# EAGLE design NU32PIC (EAGLE 5.12)
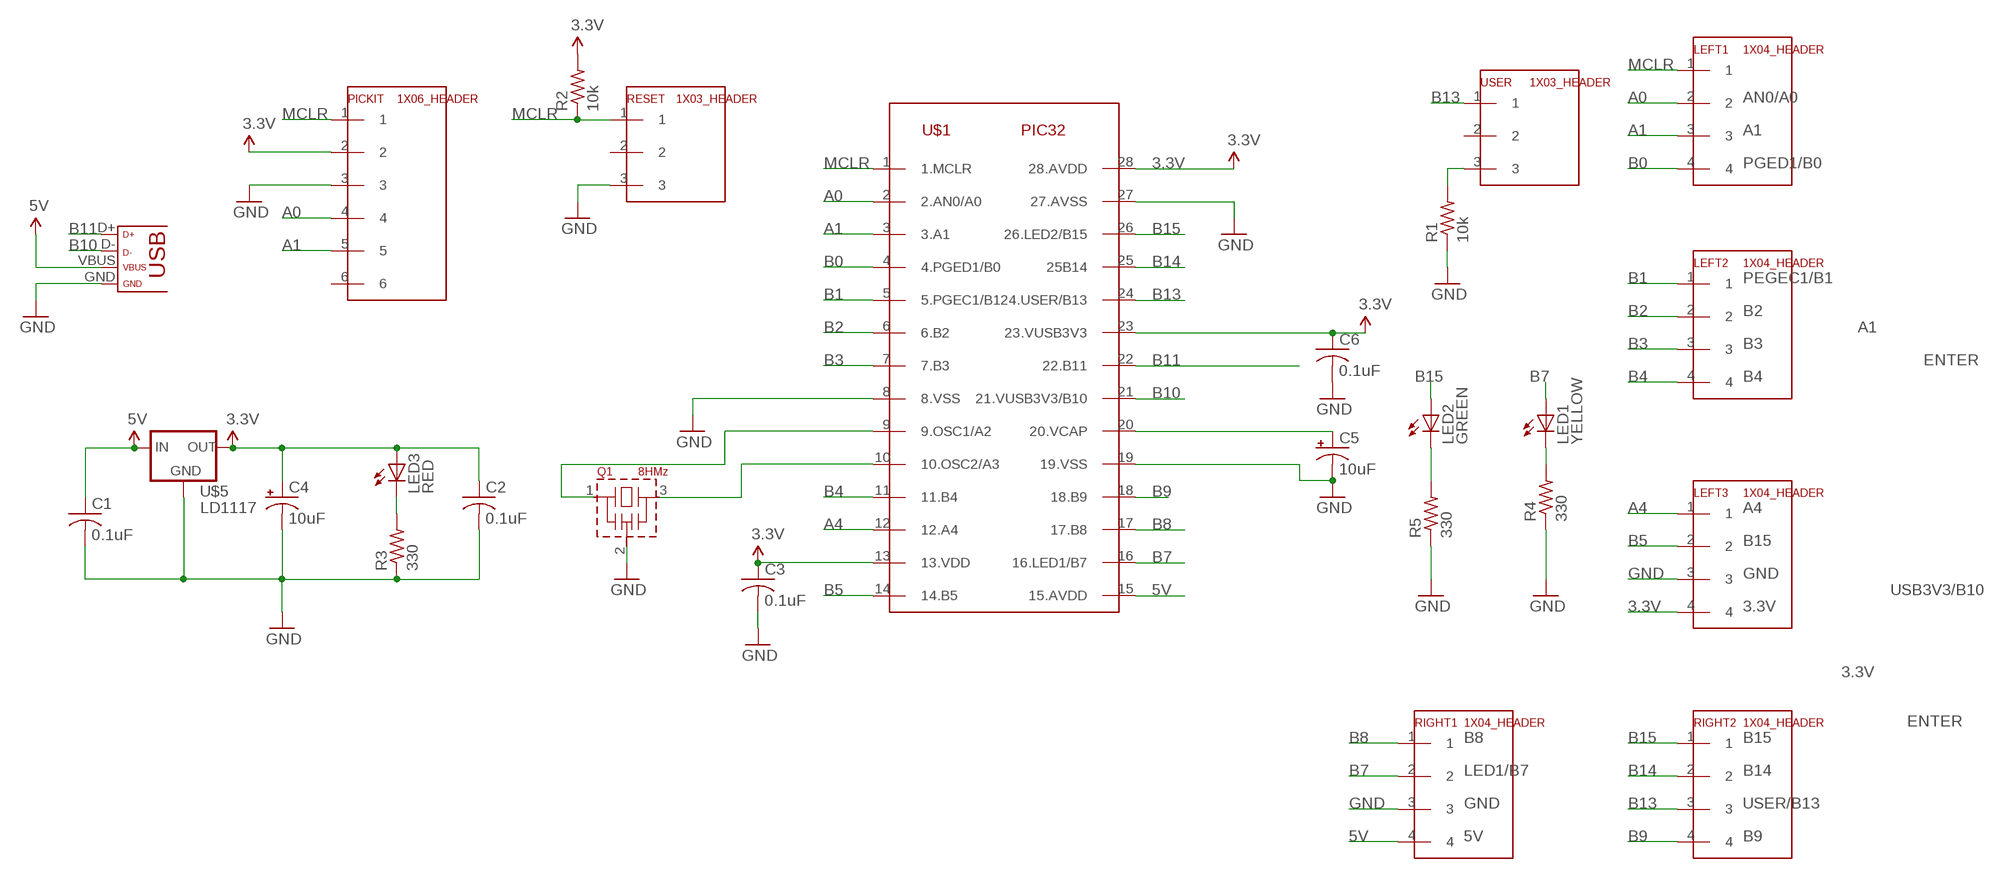
[diagram p0: schematic, sheet 1]

## Parts
C1  0.1uF  C-US025-025X050  [C025-025X050]
C2  0.1uF  C-US025-025X050  [C025-025X050]
C3  0.1uF  C-US025-025X050  [C025-025X050]
C4  10uF  CAP_POL  [CAP_POL_D]
C5  10uF  CAP_POL  [CAP_POL_D]
C6  0.1uF  C-US025-025X050  [C025-025X050]
LED1  YELLOW  LED3MM  [LED3MM]
LED2  GREEN  LED3MM  [LED3MM]
LED3  RED  LED3MM  [LED3MM]
LEFT1  1X04_HEADER  [1X04]
LEFT2  1X04_HEADER  [1X04]
LEFT3  1X04_HEADER  [1X04]
PICKIT  1X06_HEADER  [1X06]
Q1  8HMz  CSTLS_G*  [CSTLS_G9]
R1  10k  R-US_0207/10  [0207/10]
R2  10k  R-US_0207/10  [0207/10]
R3  330  R-US_0207/10  [0207/10]
R4  330  R-US_0207/10  [0207/10]
R5  330  R-US_0207/10  [0207/10]
RESET  1X03_HEADER  [1X03]
RIGHT1  1X04_HEADER  [1X04]
RIGHT2  1X04_HEADER  [1X04]
U$1  PIC32  [DIL28-3]
U$2  USB  [USB-MINIB]
U$5  LD1117  [TO220]
USER  1X03_HEADER  [1X03]

## Nets
3.3V: C2.1 C3.1 C4.1(+) C6.1 LED3.A LEFT3.4 PICKIT.2 R2.2 U$1.13(13.VDD) U$1.23(23.VUSB3V3) U$1.28(28.AVDD) U$5.2(OUT)
5V: C1.1 RIGHT1.4 U$1.15(15.AVDD) U$2.VBUS U$5.3(IN)
A0: LEFT1.2 PICKIT.4 U$1.2(2.AN0/A0)
A1: LEFT1.3 PICKIT.5 U$1.3(3.A1)
A4: LEFT3.1 U$1.12(12.A4)
B0: LEFT1.4 U$1.4(4.PGED1/B0)
B1: LEFT2.1 U$1.5(5.PGEC1/B1)
B2: LEFT2.2 U$1.6(6.B2)
B3: LEFT2.3 U$1.7(7.B3)
B4: LEFT2.4 U$1.11(11.B4)
B5: LEFT3.2 U$1.14(14.B5)
B7: LED1.A RIGHT1.2 U$1.16(16.LED1/B7)
B8: RIGHT1.1 U$1.17(17.B8)
B9: RIGHT2.4 U$1.18(18.B9)
B10: U$1.21(21.VUSB3V3/B10) U$2.D-
B11: U$1.22(22.B11) U$2.D+
B13: RIGHT2.3 U$1.24(24.USER/B13)
B14: RIGHT2.2 U$1.25(25B14)
B15: LED2.A RIGHT2.1 U$1.26(26.LED2/B15)
GND: C1.2 C2.2 C3.2 C4.2(-) C5.2(-) C6.2 LEFT3.3 PICKIT.3 Q1.2(VSS) R1.1 R3.1 R4.1 R5.1 RESET.3 RIGHT1.3 U$1.8(8.VSS) U$1.19(19.VSS) U$1.27(27.AVSS) U$2.GND U$5.1(GND)
MCLR: LEFT1.1 PICKIT.1 R2.1 RESET.1 U$1.1(1.MCLR)
N$3: LED3.K(C) R3.2
N$8: LED2.K(C) R5.2
N$11: LED1.K(C) R4.2
N$14: C5.1(+) U$1.20(20.VCAP)
N$26: Q1.1 U$1.9(9.OSC1/A2)
N$37: Q1.3 U$1.10(10.OSC2/A3)
N$38: R1.2 USER.3
Unconnected: PICKIT.6 RESET.2 USER.1 USER.2

## Notes on the sheet
- AN0/A0
- A1
- PGED1/B0
- PEGEC1/B1
- B2
- A1
- B3
- ENTER
- B4
- A4
- B15
- GND
- USB3V3/B10
- 3.3V
- 3.3V
- ENTER
- B8 | B15
- LED1/B7 | B14
- GND | USER/B13
- 5V | B9

## Library data of the parts
C1-C3 C6 = NU32PIC:C-US: CAPACITOR, American symbol
C4 C5 = NU32PIC:CAP_POL
LED1-LED3 = NU32PIC:LED: LED OSRAM: - CHIPLED LG R971, LG N971, LY N971, LG Q971, LY Q971, LO R971, LY R971 LH N974, LH R974 LS Q976, LO Q976, LY Q976 LO Q996 - Hyper CHIPLED LW Q18S LB Q993, LB Q99A, LB R99A - SideLED LS A670, LO A670, LY A670, LG A670, LP A670 LB A673, LV A673, LT A673, LW A673 LH A674 LY A675 LS A676, LA A676, LO A676, LY A676, LW A676 LS A679, LY A679, LG A679 - Hyper Micro SIDELED® LS Y876, LA Y876, LO Y876, LY Y876 LT Y87S - SmartLED LW L88C, LW L88S LB L89C, LB L89S, LG L890 LS L89K, LO L89K, LY L89K LS L896, LA L896, LO L896, LY L896 - TOPLED LS T670, LO T670, LY T670, LG T670, LP T670 LSG T670, LSP T670, LSY T670, LOP T670, LYG T670 LG T671, LOG T671, LSG T671 LB T673, LV T673, LT T673, LW T673 LH T674 LS T676, LA T676, LO T676, LY T676, LB T676, LH T676, LSB T676, LW T676 LB T67C, LV T67C, LT T67C, LS T67K, LO T67K, LY T67K, LW E67C LS E67B, LA E67B, LO E67B, LY E67B, LB E67C, LV E67C, LT E67C LW T67C LS T679, LY T679, LG T679 LS T770, LO T770, LY T770, LG T770, LP T770 LB T773, LV T773, LT T773, LW T773 LH T774 LS E675, LA E675, LY E675, LS T675 LS T776, LA T776, LO T776, LY T776, LB T776 LHGB T686 LT T68C, LB T68C - Hyper Mini TOPLED® LB M676 - Mini TOPLED Santana® LG M470 LS M47K, LO M47K, LY M47K Source: http://www.osram.convergy.de LUXEON: - LUMILED® LXK2-PW12-R00, LXK2-PW12-S00, LXK2-PW14-U00, LXK2-PW14-V00 LXK2-PM12-R00, LXK2-PM12-S00, LXK2-PM14-U00 LXK2-PE12-Q00, LXK2-PE12-R00, LXK2-PE12-S00, LXK2-PE14-T00, LXK2-PE14-U00 LXK2-PB12-K00, LXK2-PB12-L00, LXK2-PB12-M00, LXK2-PB14-N00, LXK2-PB14-P00, LXK2-PB14-Q00 LXK2-PR12-L00, LXK2-PR12-M00, LXK2-PR14-Q00, LXK2-PR14-R00 LXK2-PD12-Q00, LXK2-PD12-R00, LXK2-PD12-S00 LXK2-PH12-R00, LXK2-PH12-S00 LXK2-PL12-P00, LXK2-PL12-Q00, LXK2-PL12-R00 Source: www.luxeon.com KINGBRIGHT: KA-3528ASYC Source: www.kingbright.com
LEFT1-LEFT3 RIGHT1 RIGHT2 = NU32PIC:1X04_HEADER
PICKIT = NU32PIC:1X06_HEADER
Q1 = NU32PIC:CSTLS_G: Ceramic resonator 2.00 to 10.00 MHz
R1-R5 = NU32PIC:R-US_: RESISTOR, American symbol
RESET USER = NU32PIC:1X03_HEADER
U$1 = NU32PIC:PIC32
U$2 = NU32PIC:USB
U$5 = NU32PIC:LD1117

## Board
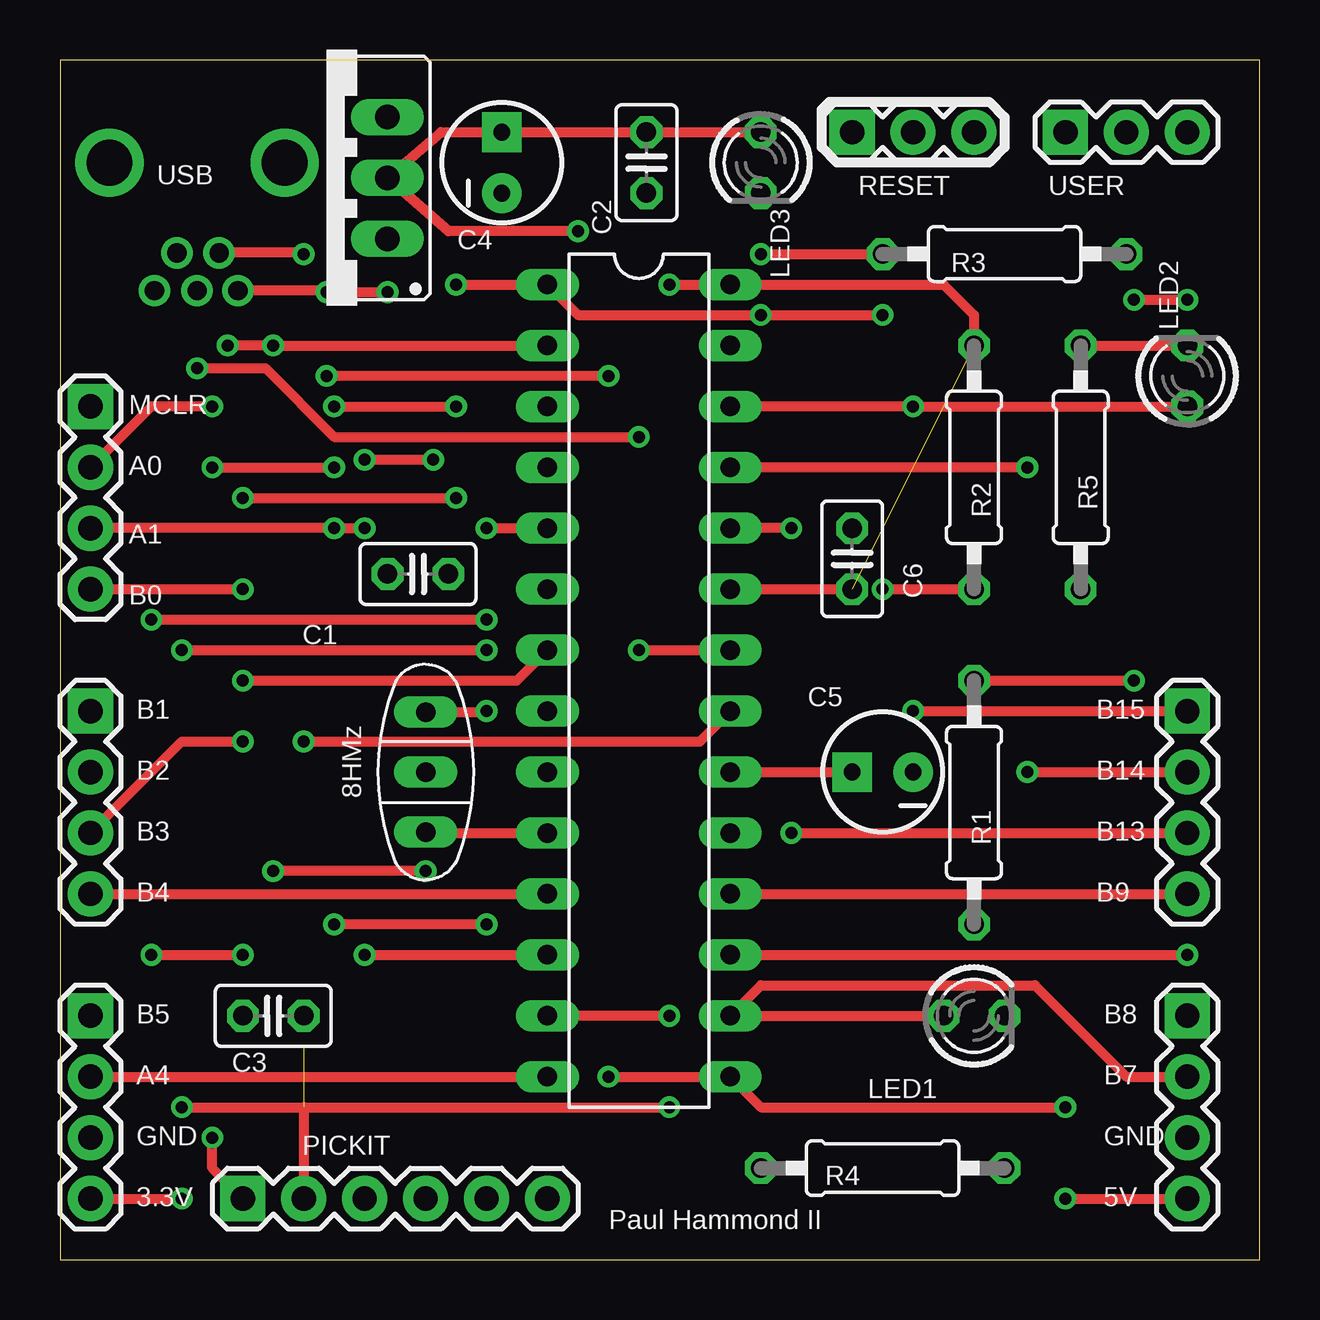
[diagram p1: board, top side]
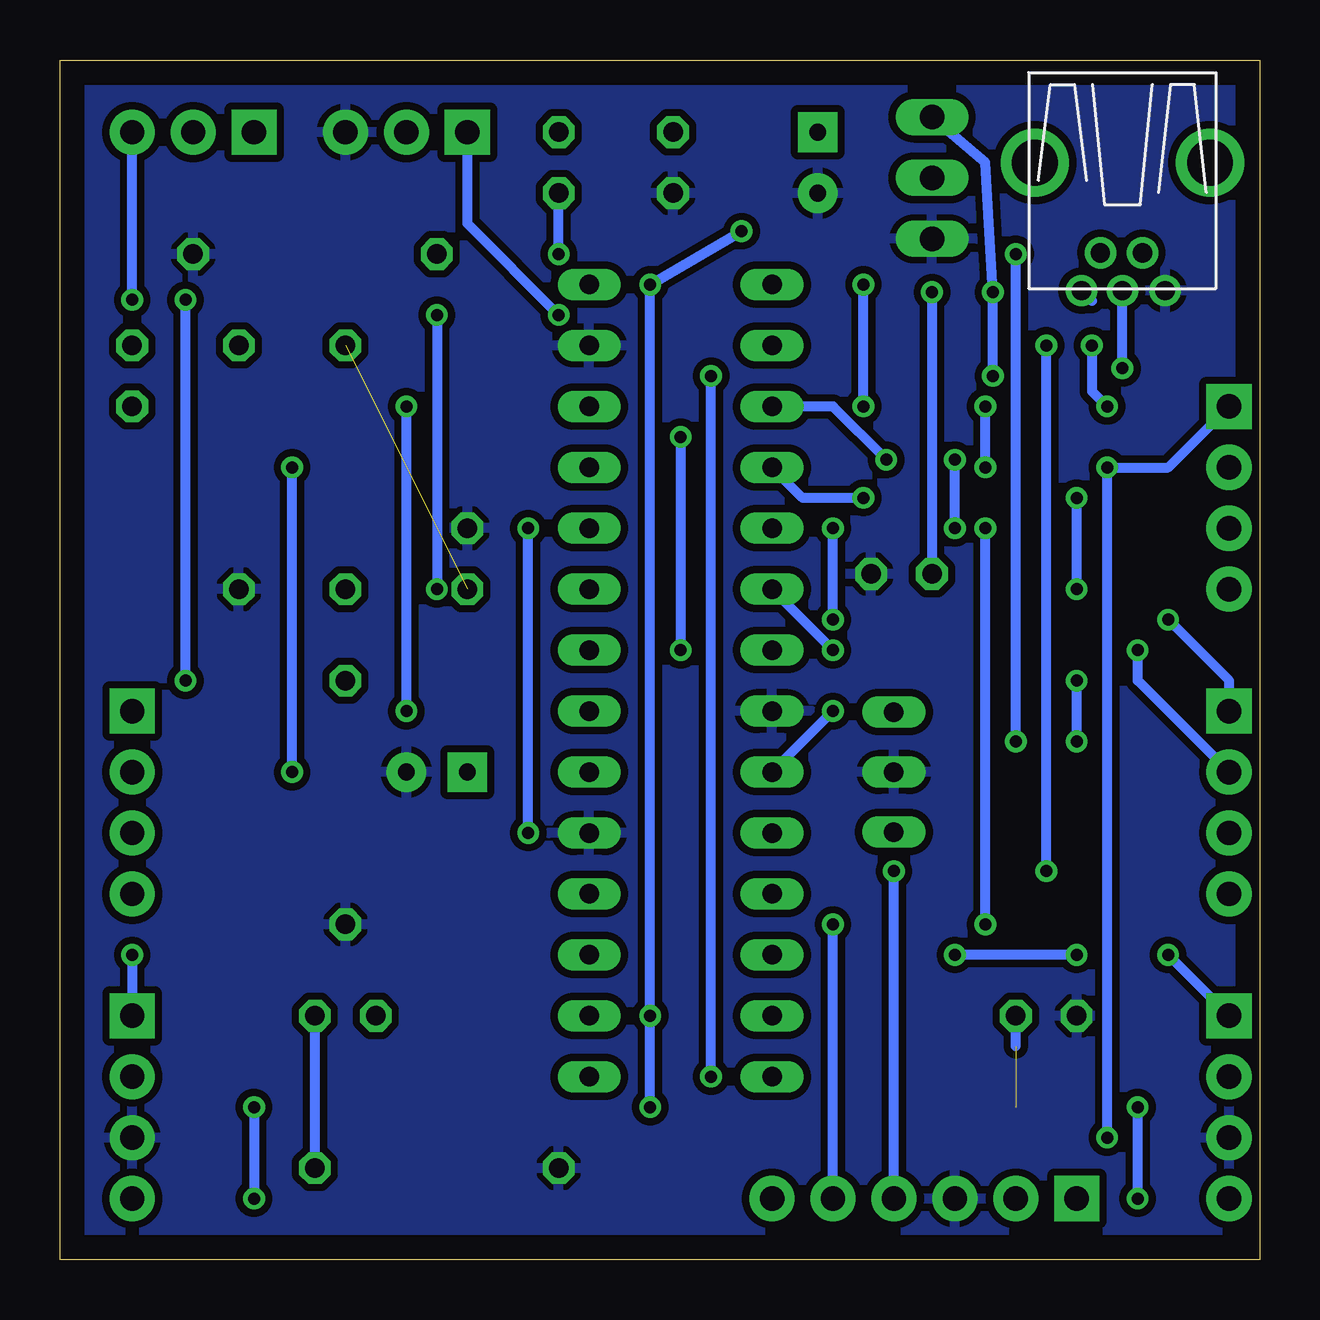
[diagram p2: board, bottom side, seen from below]

Size 50 x 50 mm. Coordinates in mm from the lower left corner, seen from the top.
Outline: 0,0 50,0 50,50 0,50 0,0
Copper layers (1*16): Top 0.035mm / dielectric 1.5mm / Bottom 0.035mm
Design rules "default": minimum track width 10mil, minimum drill 24mil, track to track 8mil, track to pad 8mil, pad to pad 8mil, via to via 8mil, smd to smd 8mil, copper to edge 40mil, drill to drill 8mil, minimum pad ring 10mil, minimum via ring 8mil, stop-mask expansion 4mil, vias tented up to drill 0mil, thermal gap 10mil

### Footprints (pad centres in the part's own frame; a part is rotated, then mirrored left to right if it is on the bottom)
C025-025X050 = drill 0.813 octagon: 1 -1.27,0; 2 1.27,0
CAP_POL_D = drill 0.7 pad 1.651 square: 1 1.27,0 | drill 0.7 pad 1.651 round: 2 -1.27,0
LED3MM = drill 0.813 octagon: A -1.27,0; K 1.27,0
1X04 = drill 1.016 pad 1.88 square: 1 0,0 | drill 1.016 pad 1.88 round: 2 2.54,0; 3 5.08,0; 4 7.62,0
1X06 = drill 1.016 pad 1.88 square: 1 0,0 | drill 1.016 pad 1.88 round: 2 2.54,0; 3 5.08,0; 4 7.62,0; 5 10.16,0; 6 12.7,0
CSTLS_G9 = drill 0.813 long: 1 -2.5,0; 2 0,0; 3 2.5,0
0207/10 = drill 0.813 octagon: 1 -5.08,0; 2 5.08,0
1X03 = drill 1.016 pad 1.88 square: 1 0,0 | drill 1.016 pad 1.88 round: 2 2.54,0; 3 5.08,0
DIL28-3 = drill 0.813 long: 1 -16.51,-3.81; 2 -13.97,-3.81; 3 -11.43,-3.81; 4 -8.89,-3.81; 5 -6.35,-3.81; 6 -3.81,-3.81; 7 -1.27,-3.81; 8 1.27,-3.81; 9 3.81,-3.81; 10 6.35,-3.81; 11 8.89,-3.81; 12 11.43,-3.81; 13 13.97,-3.81; 14 16.51,-3.81; 15 16.51,3.81; 16 13.97,3.81; 17 11.43,3.81; 18 8.89,3.81; 19 6.35,3.81; 20 3.81,3.81; 21 1.27,3.81; 22 -1.27,3.81; 23 -3.81,3.81; 24 -6.35,3.81; 25 -8.89,3.81; 26 -11.43,3.81; 27 -13.97,3.81; 28 -16.51,3.81
USB-MINIB = drill 0.8 round: D+ 4.064,0; D- 2.489,0.914; GND 4.064,-1.778; ID 2.489,-0.838; VBUS 4.064,1.702 | drill 1.9 round: P$6 -1.27,-3.65; P$7 -1.27,3.65
TO220 = drill 1.016 long: 1 -2.54,0; 2 0,0; 3 2.54,0

### Placement (x,y rotation side)
C1  14.92,28.57 0 top
C2  24.45,45.72 270 top
C3  8.89,10.16 180 top
C4  18.41,45.72 90 top
C5  34.29,20.32 180 top
C6  33.02,29.21 90 top
LED1  38.1,10.16 0 top
LED2  46.99,36.83 90 top
LED3  29.21,45.72 270 top
LEFT1  1.27,35.56 270 top
LEFT2  1.27,22.86 270 top
LEFT3  1.27,10.16 270 top
PICKIT  7.62,2.54 0 top
Q1  15.24,20.32 270 top
R1  38.1,19.05 90 top
R2  38.1,33.02 90 top
R3  39.37,41.91 180 top
R4  34.29,3.81 0 top
R5  42.55,33.02 90 top
RESET  33.02,46.99 0 top
RIGHT1  46.99,10.16 270 top
RIGHT2  46.99,22.86 270 top
U$1  24.13,24.13 270 top
U$2  5.71,44.45 270 top
U$5  13.65,45.09 90 top
USER  41.91,46.99 0 top

### Tracks (layer width: path | path; a pad name or v marks a point on that pad's centre or on a via)
3.3V  (via drill 0.5)  (2 unrouted)
  Top 0.406: R2.2 38.1,39.37 36.83,40.64 U$1.28 v25.4,40.64 | U$1.23 C6.1 | LED3.A C2.1 C4.1 15.88,46.99 U$5.2 16.19,42.86 v21.59,42.86 | v25.4,10.16 U$1.13 | 10.16,6.35 PICKIT.2 | 10.16,6.35 v25.4,6.35 | LEFT3.4 v5.08,2.54 | v5.08,6.35 10.16,6.35
  Bottom 0.406: v21.59,42.86 v25.4,40.64 v25.4,10.16 v25.4,6.35 | v5.08,2.54 v5.08,6.35 | 10.16,8.89 C3.1
5V  (via drill 0.5)
  Top 0.406: U$2.VBUS 11.05,40.39 v11.11,40.32 v13.65,40.32 | v41.91,2.54 RIGHT1.4 | v41.91,6.35 29.21,6.35 U$1.15 v22.86,7.62 | v22.86,36.83 v11.11,36.83
  Bottom 0.406: U$2.VBUS 6.99,39.95 | U$5.3 11.43,45.72 v11.11,40.32 v11.11,36.83 | v41.91,6.35 v41.91,2.54 | v22.86,7.62 v22.86,36.83 | v13.65,40.32 C1.1
A0  (via drill 0.5)
  Top 0.406: U$1.2 v8.89,38.1 v6.99,38.1 | v6.35,35.56 3.81,35.56 LEFT1.2 | v15.24,16.19 v8.89,16.19
  Bottom 0.406: v8.89,16.19 v8.89,38.1 | v6.99,38.1 6.99,36.2 v6.35,35.56 | PICKIT.4 v15.24,16.19
A1  (via drill 0.5)
  Top 0.406: v12.7,33.34 v15.56,33.34 | LEFT1.3 v11.43,30.48 v12.7,30.48 | v17.78,13.97 v11.43,13.97
  Bottom 0.406: U$1.3 17.78,35.56 v15.56,33.34 | v12.7,30.48 v12.7,33.34 | PICKIT.5 v17.78,13.97 | v11.43,13.97 v11.43,30.48
A4  (via drill 0.5)
  Top 0.406: v12.7,12.7 U$1.12 | v3.81,12.7 v7.62,12.7
  Bottom 0.406: v7.62,12.7 v12.7,12.7 | LEFT3.1 v3.81,12.7
B0  (via drill 0.5)
  Top 0.406: LEFT1.4 v7.62,27.94 | v7.62,31.75 v16.51,31.75
  Bottom 0.406: v7.62,27.94 v7.62,31.75 | v16.51,31.75 19.05,31.75 U$1.4
B1  (via drill 0.5)
  Top 0.406: v17.78,30.48 U$1.5 | v3.81,26.67 v17.78,26.67
  Bottom 0.406: v17.78,26.67 v17.78,30.48 | LEFT2.1 1.27,24.13 v3.81,26.67
B2  (via drill 0.5)
  Top 0.406: v5.08,25.4 v17.78,25.4
  Bottom 0.406: v17.78,25.4 U$1.6 | v5.08,25.4 5.08,24.13 LEFT2.2
B3  (via drill 0.5)
  Top 0.406: v7.62,24.13 19.05,24.13 U$1.7 | v7.62,21.59 5.08,21.59 LEFT2.3
  Bottom 0.406: v7.62,21.59 v7.62,24.13
B4
  Top 0.406: LEFT2.4 U$1.11
B5
  Top 0.406: LEFT3.2 U$1.14
B7
  Top 0.406: LED1.A U$1.16 29.21,11.43 40.64,11.43 44.45,7.62 RIGHT1.2
B8  (via drill 0.5)
  Top 0.406: U$1.17 v46.99,12.7
  Bottom 0.406: v46.99,12.7 RIGHT1.1
B9
  Top 0.406: U$1.18 RIGHT2.4
B10  (via drill 0.5)
  Top 0.406: U$2.D- 10.11,41.96 v10.16,41.91 | v10.16,21.59 26.67,21.59 U$1.21
  Bottom 0.406: v10.16,21.59 v10.16,41.91
B11  (via drill 0.5)
  Top 0.406: v5.71,37.15 8.57,37.15 11.43,34.29 v24.13,34.29 | v24.13,25.4 U$1.22
  Bottom 0.406: v5.71,37.15 U$2.D+ | v24.13,34.29 v24.13,25.4
B13  (via drill 0.5)
  Top 0.406: v30.48,30.48 U$1.24 | v30.48,17.78 RIGHT2.3
  Bottom 0.406: v30.48,17.78 v30.48,30.48
B14  (via drill 0.5)
  Top 0.406: v40.32,20.32 RIGHT2.2 | v40.32,33.02 U$1.25
  Bottom 0.406: v40.32,20.32 v40.32,33.02
B15  (via drill 0.5)
  Top 0.406: U$1.26 v35.56,35.56 LED2.A | v35.56,22.86 RIGHT2.1
  Bottom 0.406: v35.56,22.86 v35.56,35.56
GND
  pour Bottom (isolate 0.305): 0,49.53 49.53,49.53 49.53,0 0,0
MCLR  (via drill 0.5)
  Top 0.406: v16.51,40.64 U$1.1 21.59,39.37 v29.21,39.37 v34.29,39.37 | v11.43,35.56 v16.51,35.56 | v6.35,33.02 v11.43,33.02 | v6.35,5.08 6.35,3.81 PICKIT.1 | v34.29,27.94 R2.1
  Bottom 0.406: RESET.1 33.02,43.18 v29.21,39.37 | v16.51,35.56 v16.51,40.64 | v11.43,33.02 v11.43,35.56 | LEFT1.1 3.81,33.02 v6.35,33.02 v6.35,5.08 | v34.29,39.37 v34.29,27.94
N$3  (via drill 0.5)
  Top 0.406: v29.21,41.91 R3.2
  Bottom 0.406: v29.21,41.91 LED3.K
N$8
  Top 0.406: R5.2 LED2.K
N$11
  Bottom 0.406: R4.2 LED1.K
N$14
  Top 0.406: U$1.20 C5.1
N$26  (via drill 0.5)
  Top 0.406: Q1.1 17.74,22.82 v17.78,22.86
  Bottom 0.406: v17.78,22.86 U$1.9
N$37
  Top 0.406: U$1.10 15.28,17.78 Q1.3
N$38  (via drill 0.5)
  Top 0.406: v44.77,40.01 v46.99,40.01 | R1.2 v44.77,24.13
  Bottom 0.406: v46.99,40.01 USER.3 | v44.77,24.13 v44.77,40.01

### Text on the board
tPlace: MCLR | A0 | A1 | B0 | B1 | B15 | B2 | B14 | B3 | B13 | B4 | B9 | B5 | B8 | A4 | B7 | GND | GND | 3.3V | 5V
tNames: Paul Hammond II